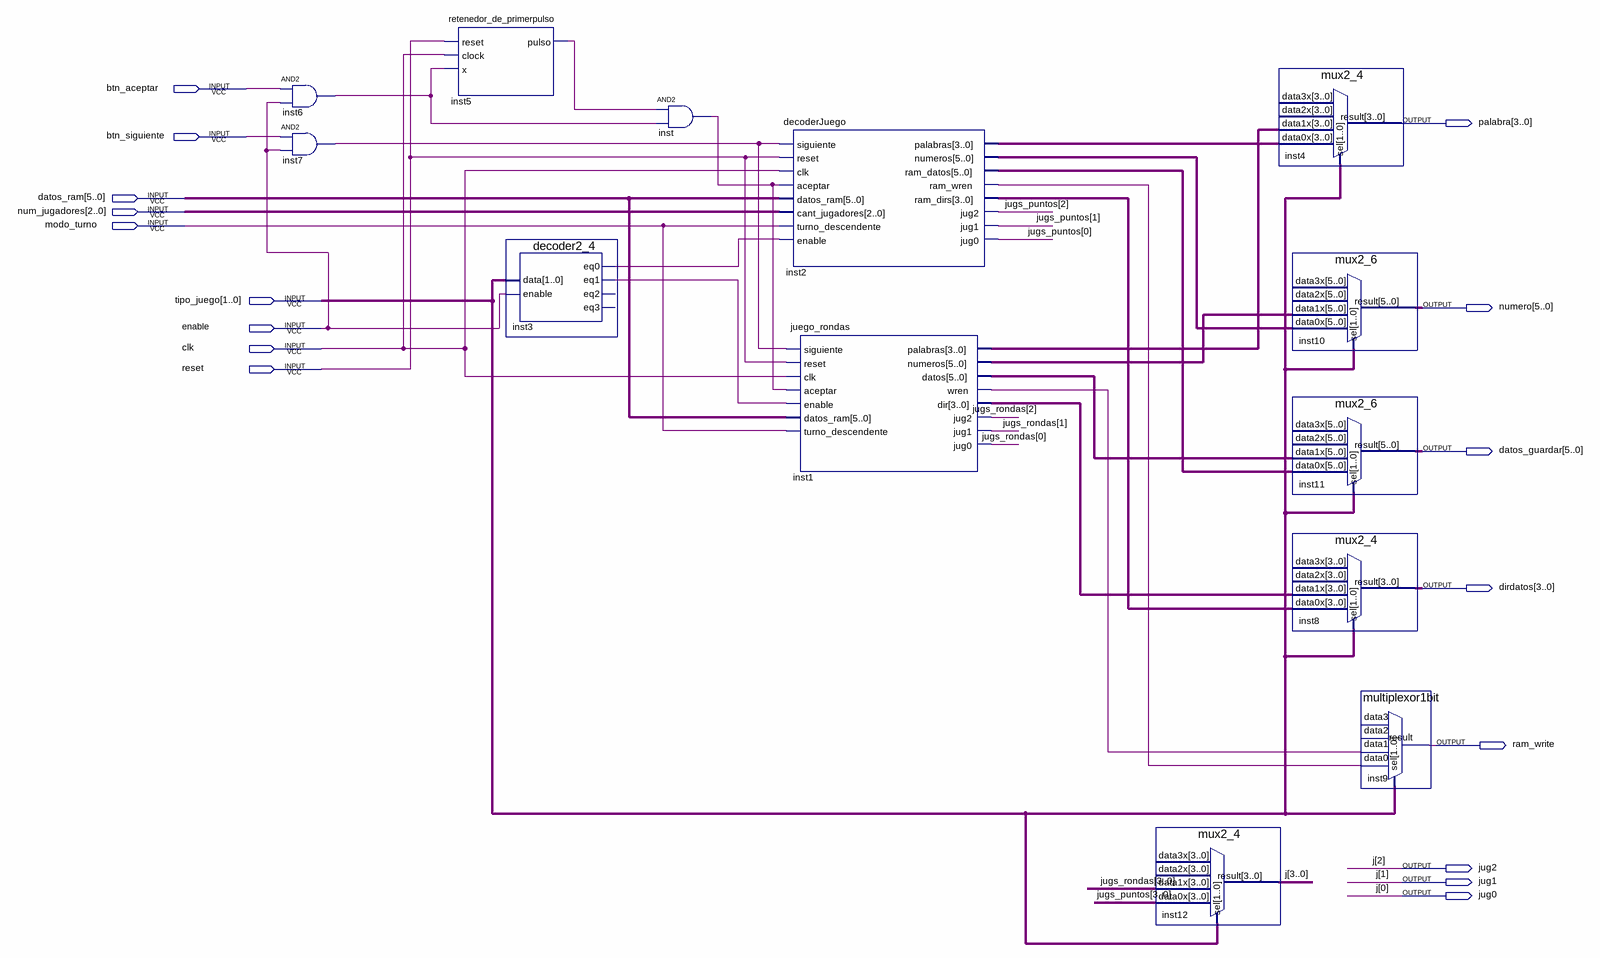
[diagram p0: schematic sheet]
// Quartus schematic bloque_juego.bdf as structural Verilog: 13 symbols, 17 pins
module bloque_juego (
  input  btn_aceptar,
  input  btn_siguiente,
  input  [5:0] datos_ram,
  input  [2:0] num_jugadores,
  input  modo_turno,
  input  [1:0] tipo_juego,
  input  enable,
  input  clk,
  input  reset,
  output [3:0] palabra,
  output [5:0] numero,
  output [5:0] datos_guardar,
  output [3:0] dirdatos,
  output ram_write,
  output jug2,
  output jug1,
  output jug0
);

  wire inst1_wren, inst2_ram_wren, inst3_eq0, inst3_eq1, inst5_pulso, inst6_out, inst7_out, inst_out;
  wire [3:0] inst1_dir, inst1_palabras, inst2_palabras, inst2_ram_dirs, jugs_puntos, jugs_rondas;
  wire [3:3] j;
  wire [5:0] inst1_datos, inst1_numeros, inst2_numeros, inst2_ram_datos;

  and inst6 (inst6_out, btn_aceptar, enable);
  and inst7 (inst7_out, btn_siguiente, enable);
  retenedor_de_primerpulso inst5 (.reset(reset), .clock(clk), .x(inst6_out), .pulso(inst5_pulso));
  decoder2_4 inst3 (.data(tipo_juego), .enable(enable), .eq0(inst3_eq0), .eq1(inst3_eq1));  // open: eq2, eq3
  and inst (inst_out, inst5_pulso, inst6_out);
  decoderJuego inst2 (
    .siguiente(inst7_out), .reset(reset), .clk(clk), .aceptar(inst_out), .datos_ram(datos_ram),
    .cant_jugadores(num_jugadores), .turno_descendente(modo_turno), .enable(inst3_eq0),
    .palabras(inst2_palabras), .numeros(inst2_numeros), .ram_datos(inst2_ram_datos),
    .ram_wren(inst2_ram_wren), .ram_dirs(inst2_ram_dirs), .jug2(jugs_puntos[2]), .jug1(jugs_puntos[1]),
    .jug0(jugs_puntos[0]));
  juego_rondas inst1 (
    .siguiente(inst7_out), .reset(reset), .clk(clk), .aceptar(inst_out), .enable(inst3_eq1),
    .datos_ram(datos_ram), .turno_descendente(modo_turno), .palabras(inst1_palabras),
    .numeros(inst1_numeros), .datos(inst1_datos), .wren(inst1_wren), .dir(inst1_dir), .jug2(jugs_rondas[2]),
    .jug1(jugs_rondas[1]), .jug0(jugs_rondas[0]));
  mux2_4 inst12 (
    .data1x(jugs_rondas), .data0x(jugs_puntos), .sel(tipo_juego), .result({j[3], jug2, jug1, jug0}));  // open: data3x, data2x
  mux2_4 inst4 (
    .data1x(inst1_palabras), .data0x(inst2_palabras), .sel(tipo_juego), .result(palabra));  // open: data3x, data2x
  mux2_6 inst10 (
    .data1x(inst1_numeros), .data0x(inst2_numeros), .sel(tipo_juego), .result(numero));  // open: data3x, data2x
  mux2_6 inst11 (
    .data1x(inst1_datos), .data0x(inst2_ram_datos), .sel(tipo_juego), .result(datos_guardar));  // open: data3x, data2x
  mux2_4 inst8 (
    .data1x(inst1_dir), .data0x(inst2_ram_dirs), .sel(tipo_juego), .result(dirdatos));  // open: data3x, data2x
  multiplexor1bit inst9 (
    .data1(inst1_wren), .data0(inst2_ram_wren), .sel(tipo_juego), .result(ram_write));  // open: data3, data2

  // Other names for the same wires on the sheet: j[2:0] = {jug2, jug1, jug0}
endmodule
